# Altium schematic sheet SoM-MGTH.SchDoc
size A3; DocumentNumber: 4; SheetNumber: 4; SheetTotal: 9; PageSetup: Record=PageOptions|CenterHorizontal=True|CenterVertical=True|PrintScale=0.97|XCorrection=1.00|YCorrection=1.00|PrintKind=1|BorderSize=5000000|LeftOffset=0|BottomOffset=0|Orientation=2|PaperLength=2970|PaperWidth=2100|Scale=100|PaperSource=7|PrintQuality=600|MediaType=1|DitherType=10|PaperKind=A4|PrintScaleMode=1
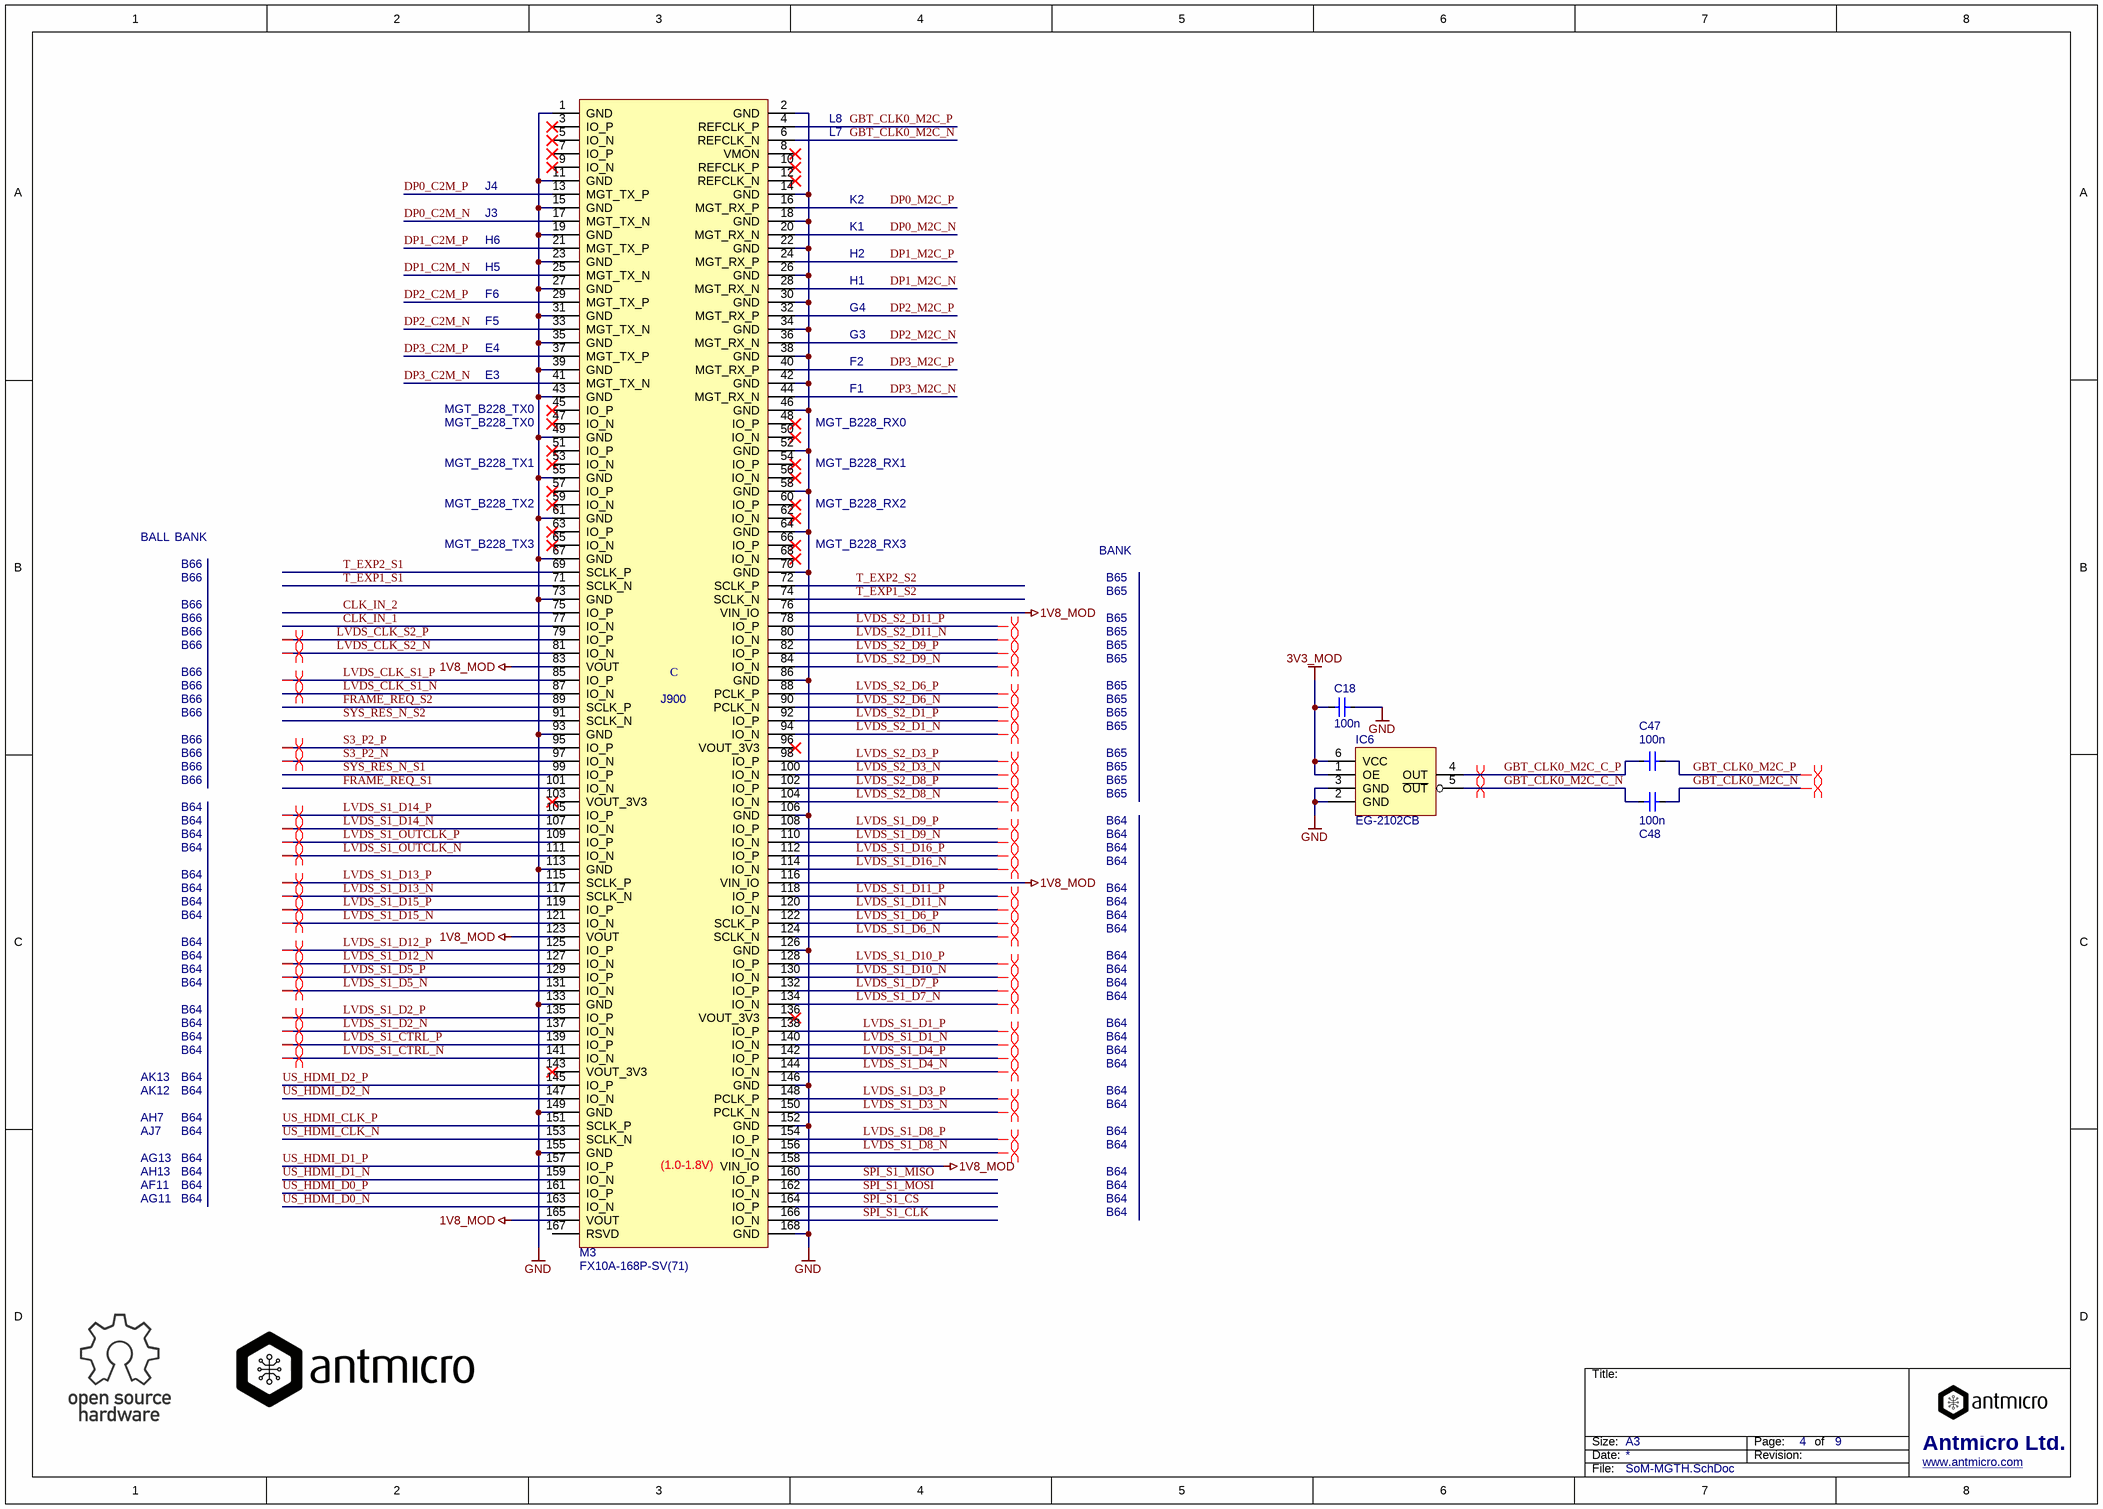
[diagram p0: SoM-MGTH.SchDoc]

## Parts
C18  100n  [0402]
C47  100n  [0402]
C48  100n  [0402]
IC6  EG-2102CB  [EG-2102CB]
M3  FX10A-168P-SV(71)  [HIROSE_FX10A-168P-SV(71)]

## Nets
1V8_MOD: M3.76(VIN_IO) M3.83(VOUT) M3.116(VIN_IO) M3.123(VOUT) M3.158(VIN_IO) M3.165(VOUT)
3V3_MOD: C18.2 IC6.1(OE) IC6.6(VCC)
GND: C18.1 IC6.2(GND) IC6.3(GND) M3.1(GND) M3.2(GND) M3.11(GND) M3.14(GND) M3.15(GND) M3.18(GND) M3.19(GND) M3.22(GND) M3.23(GND) M3.26(GND) M3.27(GND) M3.30(GND) M3.31(GND) M3.34(GND) M3.35(GND) M3.38(GND) M3.39(GND) M3.42(GND) M3.43(GND) M3.46(GND) M3.49(GND) M3.52(GND) M3.55(GND) M3.58(GND) M3.61(GND) M3.64(GND) M3.67(GND) M3.70(GND) M3.73(GND) M3.86(GND) M3.93(GND) M3.106(GND) M3.113(GND) M3.126(GND) M3.133(GND) M3.146(GND) M3.149(GND) M3.152(GND) M3.155(GND) M3.168(GND)
CLK_IN_1: M3.77(IO_N)
CLK_IN_2: M3.75(IO_P)
DP0_C2M_N: M3.17(MGT_TX_N)
DP0_C2M_P: M3.13(MGT_TX_P)
DP0_M2C_N: M3.20(MGT_RX_N)
DP0_M2C_P: M3.16(MGT_RX_P)
DP1_C2M_N: M3.25(MGT_TX_N)
DP1_C2M_P: M3.21(MGT_TX_P)
DP1_M2C_N: M3.28(MGT_RX_N)
DP1_M2C_P: M3.24(MGT_RX_P)
DP2_C2M_N: M3.33(MGT_TX_N)
DP2_C2M_P: M3.29(MGT_TX_P)
DP2_M2C_N: M3.36(MGT_RX_N)
DP2_M2C_P: M3.32(MGT_RX_P)
DP3_C2M_N: M3.41(MGT_TX_N)
DP3_C2M_P: M3.37(MGT_TX_P)
DP3_M2C_N: M3.44(MGT_RX_N)
DP3_M2C_P: M3.40(MGT_RX_P)
FRAME_REQ_S1: M3.101(IO_N)
FRAME_REQ_S2: M3.89(SCLK_P)
GBT_CLK0_M2C_C_N: C48.1 IC6.5(~{OUT})
GBT_CLK0_M2C_C_P: C47.1 IC6.4(OUT)
GBT_CLK0_M2C_N: C48.2 M3.6(REFCLK_N)
GBT_CLK0_M2C_P: C47.2 M3.4(REFCLK_P)
LVDS_CLK_S1_N: M3.87(IO_N)
LVDS_CLK_S1_P: M3.85(IO_P)
LVDS_CLK_S2_N: M3.81(IO_N)
LVDS_CLK_S2_P: M3.79(IO_P)
LVDS_S1_CTRL_N: M3.141(IO_N)
LVDS_S1_CTRL_P: M3.139(IO_P)
LVDS_S1_D1_N: M3.140(IO_N)
LVDS_S1_D1_P: M3.138(IO_P)
LVDS_S1_D2_N: M3.137(IO_N)
LVDS_S1_D2_P: M3.135(IO_P)
LVDS_S1_D3_N: M3.150(PCLK_N)
LVDS_S1_D3_P: M3.148(PCLK_P)
LVDS_S1_D4_N: M3.144(IO_N)
LVDS_S1_D4_P: M3.142(IO_P)
LVDS_S1_D5_N: M3.131(IO_N)
LVDS_S1_D5_P: M3.129(IO_P)
LVDS_S1_D6_N: M3.124(SCLK_N)
LVDS_S1_D6_P: M3.122(SCLK_P)
LVDS_S1_D7_N: M3.134(IO_N)
LVDS_S1_D7_P: M3.132(IO_P)
LVDS_S1_D8_N: M3.156(IO_N)
LVDS_S1_D8_P: M3.154(IO_P)
LVDS_S1_D9_N: M3.110(IO_N)
LVDS_S1_D9_P: M3.108(IO_P)
LVDS_S1_D10_N: M3.130(IO_N)
LVDS_S1_D10_P: M3.128(IO_P)
LVDS_S1_D11_N: M3.120(IO_N)
LVDS_S1_D11_P: M3.118(IO_P)
LVDS_S1_D12_N: M3.127(IO_N)
LVDS_S1_D12_P: M3.125(IO_P)
LVDS_S1_D13_N: M3.117(SCLK_N)
LVDS_S1_D13_P: M3.115(SCLK_P)
LVDS_S1_D14_N: M3.107(IO_N)
LVDS_S1_D14_P: M3.105(IO_P)
LVDS_S1_D15_N: M3.121(IO_N)
LVDS_S1_D15_P: M3.119(IO_P)
LVDS_S1_D16_N: M3.114(IO_N)
LVDS_S1_D16_P: M3.112(IO_P)
LVDS_S1_OUTCLK_N: M3.111(IO_N)
LVDS_S1_OUTCLK_P: M3.109(IO_P)
LVDS_S2_D1_N: M3.94(IO_N)
LVDS_S2_D1_P: M3.92(IO_P)
LVDS_S2_D3_N: M3.100(IO_N)
LVDS_S2_D3_P: M3.98(IO_P)
LVDS_S2_D6_N: M3.90(PCLK_N)
LVDS_S2_D6_P: M3.88(PCLK_P)
LVDS_S2_D8_N: M3.104(IO_N)
LVDS_S2_D8_P: M3.102(IO_P)
LVDS_S2_D9_N: M3.84(IO_N)
LVDS_S2_D9_P: M3.82(IO_P)
LVDS_S2_D11_N: M3.80(IO_N)
LVDS_S2_D11_P: M3.78(IO_P)
S3_P2_N: M3.97(IO_N)
S3_P2_P: M3.95(IO_P)
SPI_S1_CLK: M3.166(IO_N)
SPI_S1_CS: M3.164(IO_P)
SPI_S1_MISO: M3.160(IO_P)
SPI_S1_MOSI: M3.162(IO_N)
SYS_RES_N_S1: M3.99(IO_P)
SYS_RES_N_S2: M3.91(SCLK_N)
T_EXP1_S1: M3.71(SCLK_N)
T_EXP1_S2: M3.74(SCLK_N)
T_EXP2_S1: M3.69(SCLK_P)
T_EXP2_S2: M3.72(SCLK_P)
US_HDMI_CLK_N: M3.153(SCLK_N)
US_HDMI_CLK_P: M3.151(SCLK_P)
US_HDMI_D0_N: M3.163(IO_N)
US_HDMI_D0_P: M3.161(IO_P)
US_HDMI_D1_N: M3.159(IO_N)
US_HDMI_D1_P: M3.157(IO_P)
US_HDMI_D2_N: M3.147(IO_N)
US_HDMI_D2_P: M3.145(IO_P)

Not connected (* = marked no-connect by the designer): M3 3(IO_P)* 5(IO_N)* 7(IO_P)* 8(VMON)* 9(IO_N)* 10(REFCLK_P)* 12(REFCLK_N)* 45(IO_P)* 47(IO_N)* 48(IO_P)* 50(IO_N)* 51(IO_P)* 53(IO_N)* 54(IO_P)* 56(IO_N)* 57(IO_P)* 59(IO_N)* 60(IO_P)* 62(IO_N)* 63(IO_P)* 65(IO_N)* 66(IO_P)* 68(IO_N)* 96(VOUT_3V3)* 103(VOUT_3V3)* 136(VOUT_3V3)* 143(VOUT_3V3)* 167(RSVD)

## Layout directives
differential pair: GBT_CLK0_M2C_C_N, GBT_CLK0_M2C_C_P, GBT_CLK0_M2C_N, GBT_CLK0_M2C_P, LVDS_CLK_S1_N, LVDS_CLK_S1_P, LVDS_CLK_S2_N, LVDS_CLK_S2_P, LVDS_S1_CTRL_N, LVDS_S1_CTRL_P, LVDS_S1_D1_N, LVDS_S1_D1_P, LVDS_S1_D2_N, LVDS_S1_D2_P, LVDS_S1_D3_N, LVDS_S1_D3_P, LVDS_S1_D4_N, LVDS_S1_D4_P, LVDS_S1_D5_N, LVDS_S1_D5_P, LVDS_S1_D6_N, LVDS_S1_D6_P, LVDS_S1_D7_N, LVDS_S1_D7_P, LVDS_S1_D8_N, LVDS_S1_D8_P, LVDS_S1_D9_N, LVDS_S1_D9_P, LVDS_S1_D10_N, LVDS_S1_D10_P, LVDS_S1_D11_N, LVDS_S1_D11_P, LVDS_S1_D12_N, LVDS_S1_D12_P, LVDS_S1_D13_N, LVDS_S1_D13_P, LVDS_S1_D14_N, LVDS_S1_D14_P, LVDS_S1_D15_N, LVDS_S1_D15_P, LVDS_S1_D16_N, LVDS_S1_D16_P, LVDS_S1_OUTCLK_N, LVDS_S1_OUTCLK_P, LVDS_S2_D1_N, LVDS_S2_D1_P, LVDS_S2_D3_N, LVDS_S2_D3_P, LVDS_S2_D6_N, LVDS_S2_D6_P, LVDS_S2_D8_N, LVDS_S2_D8_P, LVDS_S2_D9_N, LVDS_S2_D9_P, LVDS_S2_D11_N, LVDS_S2_D11_P, S3_P2_N, S3_P2_P

## Notes on the sheet
- L8
- L7
- J3
- J4
- H6
- K2
- K1
- H5
- F6
- H2
- H1
- G4
- F5
- E3
- E4
- G3
- F2
- MGT_B228_TX0
- (near M3) MGT_B228_RX0
- F1
- MGT_B228_TX1
- MGT_B228_TX2
- (near M3) MGT_B228_RX1
- (near M3) MGT_B228_RX2
- BALL
- BANK
- B66
- MGT_B228_TX3
- (near M3) MGT_B228_RX3
- B65
- (near M3) J900
- B64
- AK13
- AK12
- AH7
- AJ7
- AG13
- AH13
- AF11
- (near M3) (1.0-1.8V)
- AG11
- Title:
- Size:
- Date:
- A3
- Revision:
- Page:
- of
- Antmicro Ltd.
- File:
- www.antmicro.com
- (in symbol Mercury_US1_C) C

## Library data of the parts
C18 C47 C48 = C_100n_0402: MLCC SMT Capacitor 100nF 0402; Manufacturer: MULTICOMP; MPN: MC0402X104M100CT; Value: 100n; Part Number: C_100n_0402
IC6 = EG-2102CB: Standard Clock Oscillators 156.25MHz 3V3; Manufacturer: Epson; MPN: EG-2102CB 156.2500M-LGPAL3; Part Number: EG-2102CB; Value: EG-2102CB
M3 = Mercury_US1_C: Enclustra Mercury Ultrascale connector; Manufacturer: Hirose; Part Number: Mercury_US1_C; Value: FX10A-168P-SV(71); MPN: FX10A-168P-SV(71)